# Altium schematic sheet Snip_Top.SchDoc
size A
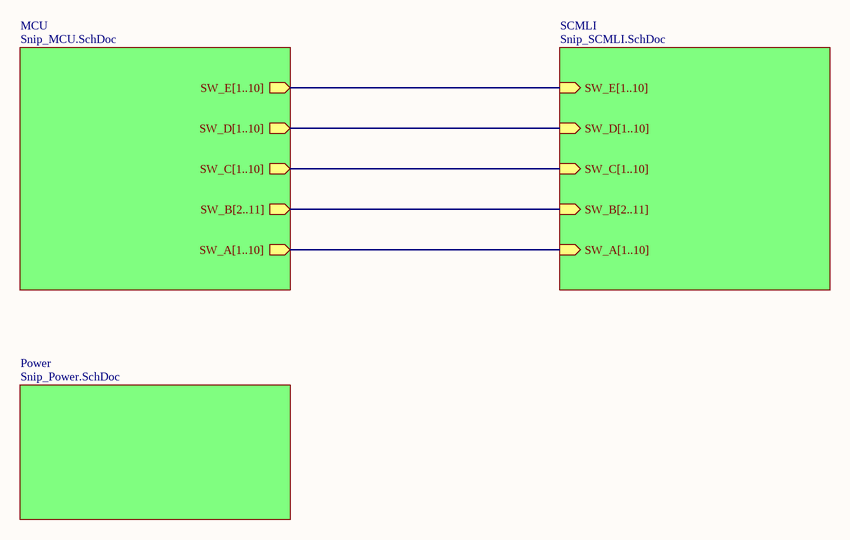
[diagram p0: Snip_Top.SchDoc]

## Sub-sheets
MCU = Snip_MCU.SchDoc: SW_B[2..11] (out), SW_A[1..10] (out), SW_D[1..10] (out), SW_E[1..10] (out), SW_C[1..10] (out)
Power = Snip_Power.SchDoc: no entries
SCMLI = Snip_SCMLI.SchDoc: SW_B[2..11] (in), SW_A[1..10] (in), SW_C[1..10] (in), SW_E[1..10] (in), SW_D[1..10] (in)

## Buses and harness runs
bus sheet MCU/SW_A[1..10] = sheet SCMLI/SW_A[1..10]
bus sheet MCU/SW_B[2..11] = sheet SCMLI/SW_B[2..11]
bus sheet MCU/SW_C[1..10] = sheet SCMLI/SW_C[1..10]
bus sheet MCU/SW_D[1..10] = sheet SCMLI/SW_D[1..10]
bus sheet MCU/SW_E[1..10] = sheet SCMLI/SW_E[1..10]